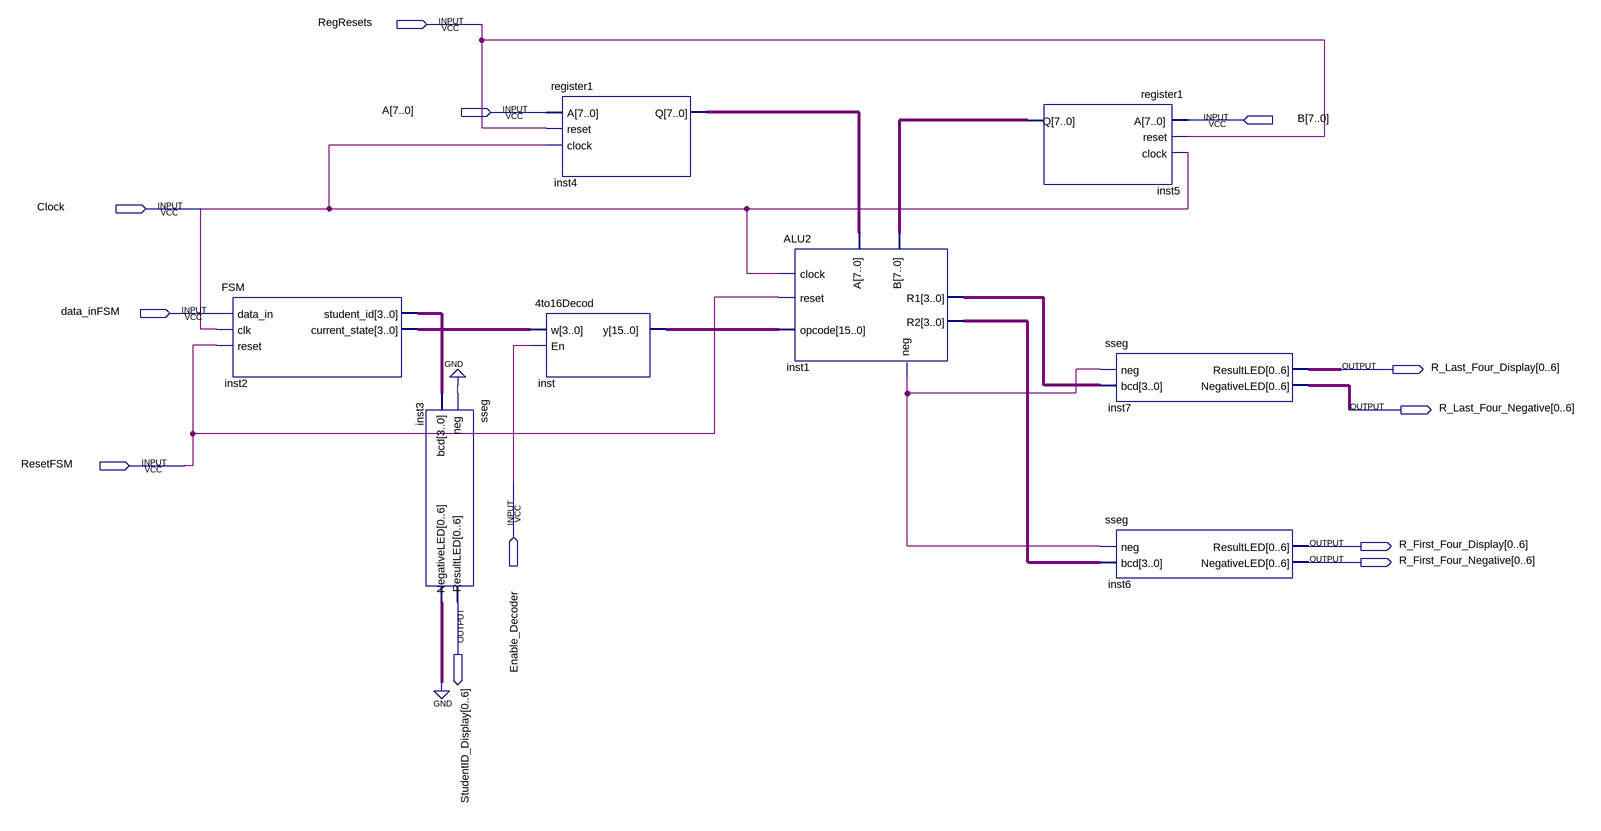
[diagram p0: schematic sheet]
// Quartus schematic Circuit2.bdf as structural Verilog: 8 symbols, 12 pins
module Circuit2 (
  input  RegResets,
  input  [7:0] A,
  input  [7:0] B,
  input  Clock,
  input  data_inFSM,
  input  ResetFSM,
  input  Enable_Decoder,
  output [0:6] R_Last_Four_Display,
  output [0:6] R_Last_Four_Negative,
  output [0:6] R_First_Four_Display,
  output [0:6] R_First_Four_Negative,
  output [0:6] StudentID_Display
);

  wire inst1_neg;
  wire [3:0] inst1_r1, inst1_r2, inst2_current_state, inst2_student_id;
  wire [6:0] inst3_negativeled;
  wire [7:0] inst4_q, inst5_q;
  wire [15:0] inst_y;

  FSM inst2 (
    .data_in(data_inFSM), .clk(Clock), .reset(ResetFSM), .student_id(inst2_student_id),
    .current_state(inst2_current_state));
  sseg inst3 (.neg(1'b0), .bcd(inst2_student_id), .ResultLED(StudentID_Display), .NegativeLED(inst3_negativeled));
  register1 inst4 (.A(A), .reset(RegResets), .clock(Clock), .Q(inst4_q));
  \4to16Decod  inst (.w(inst2_current_state), .En(Enable_Decoder), .y(inst_y));
  ALU2 inst1 (
    .clock(Clock), .reset(ResetFSM), .A(inst4_q), .B(inst5_q), .opcode(inst_y), .neg(inst1_neg),
    .R1(inst1_r1), .R2(inst1_r2));
  register1 inst5 (.A(B), .reset(RegResets), .clock(Clock), .Q(inst5_q));
  sseg inst7 (.neg(inst1_neg), .bcd(inst1_r1), .ResultLED(R_Last_Four_Display), .NegativeLED(R_Last_Four_Negative));
  sseg inst6 (.neg(inst1_neg), .bcd(inst1_r2), .ResultLED(R_First_Four_Display), .NegativeLED(R_First_Four_Negative));
  // also tied to GND on the sheet: {inst3_negativeled[0], inst3_negativeled[1], inst3_negativeled[2], inst3_negativeled[3], inst3_negativeled[4], inst3_negativeled[5], inst3_negativeled[6]}
endmodule
